# Altium schematic sheet Main.SchDoc
size A3; SheetNumber: 1; SheetTotal: 1
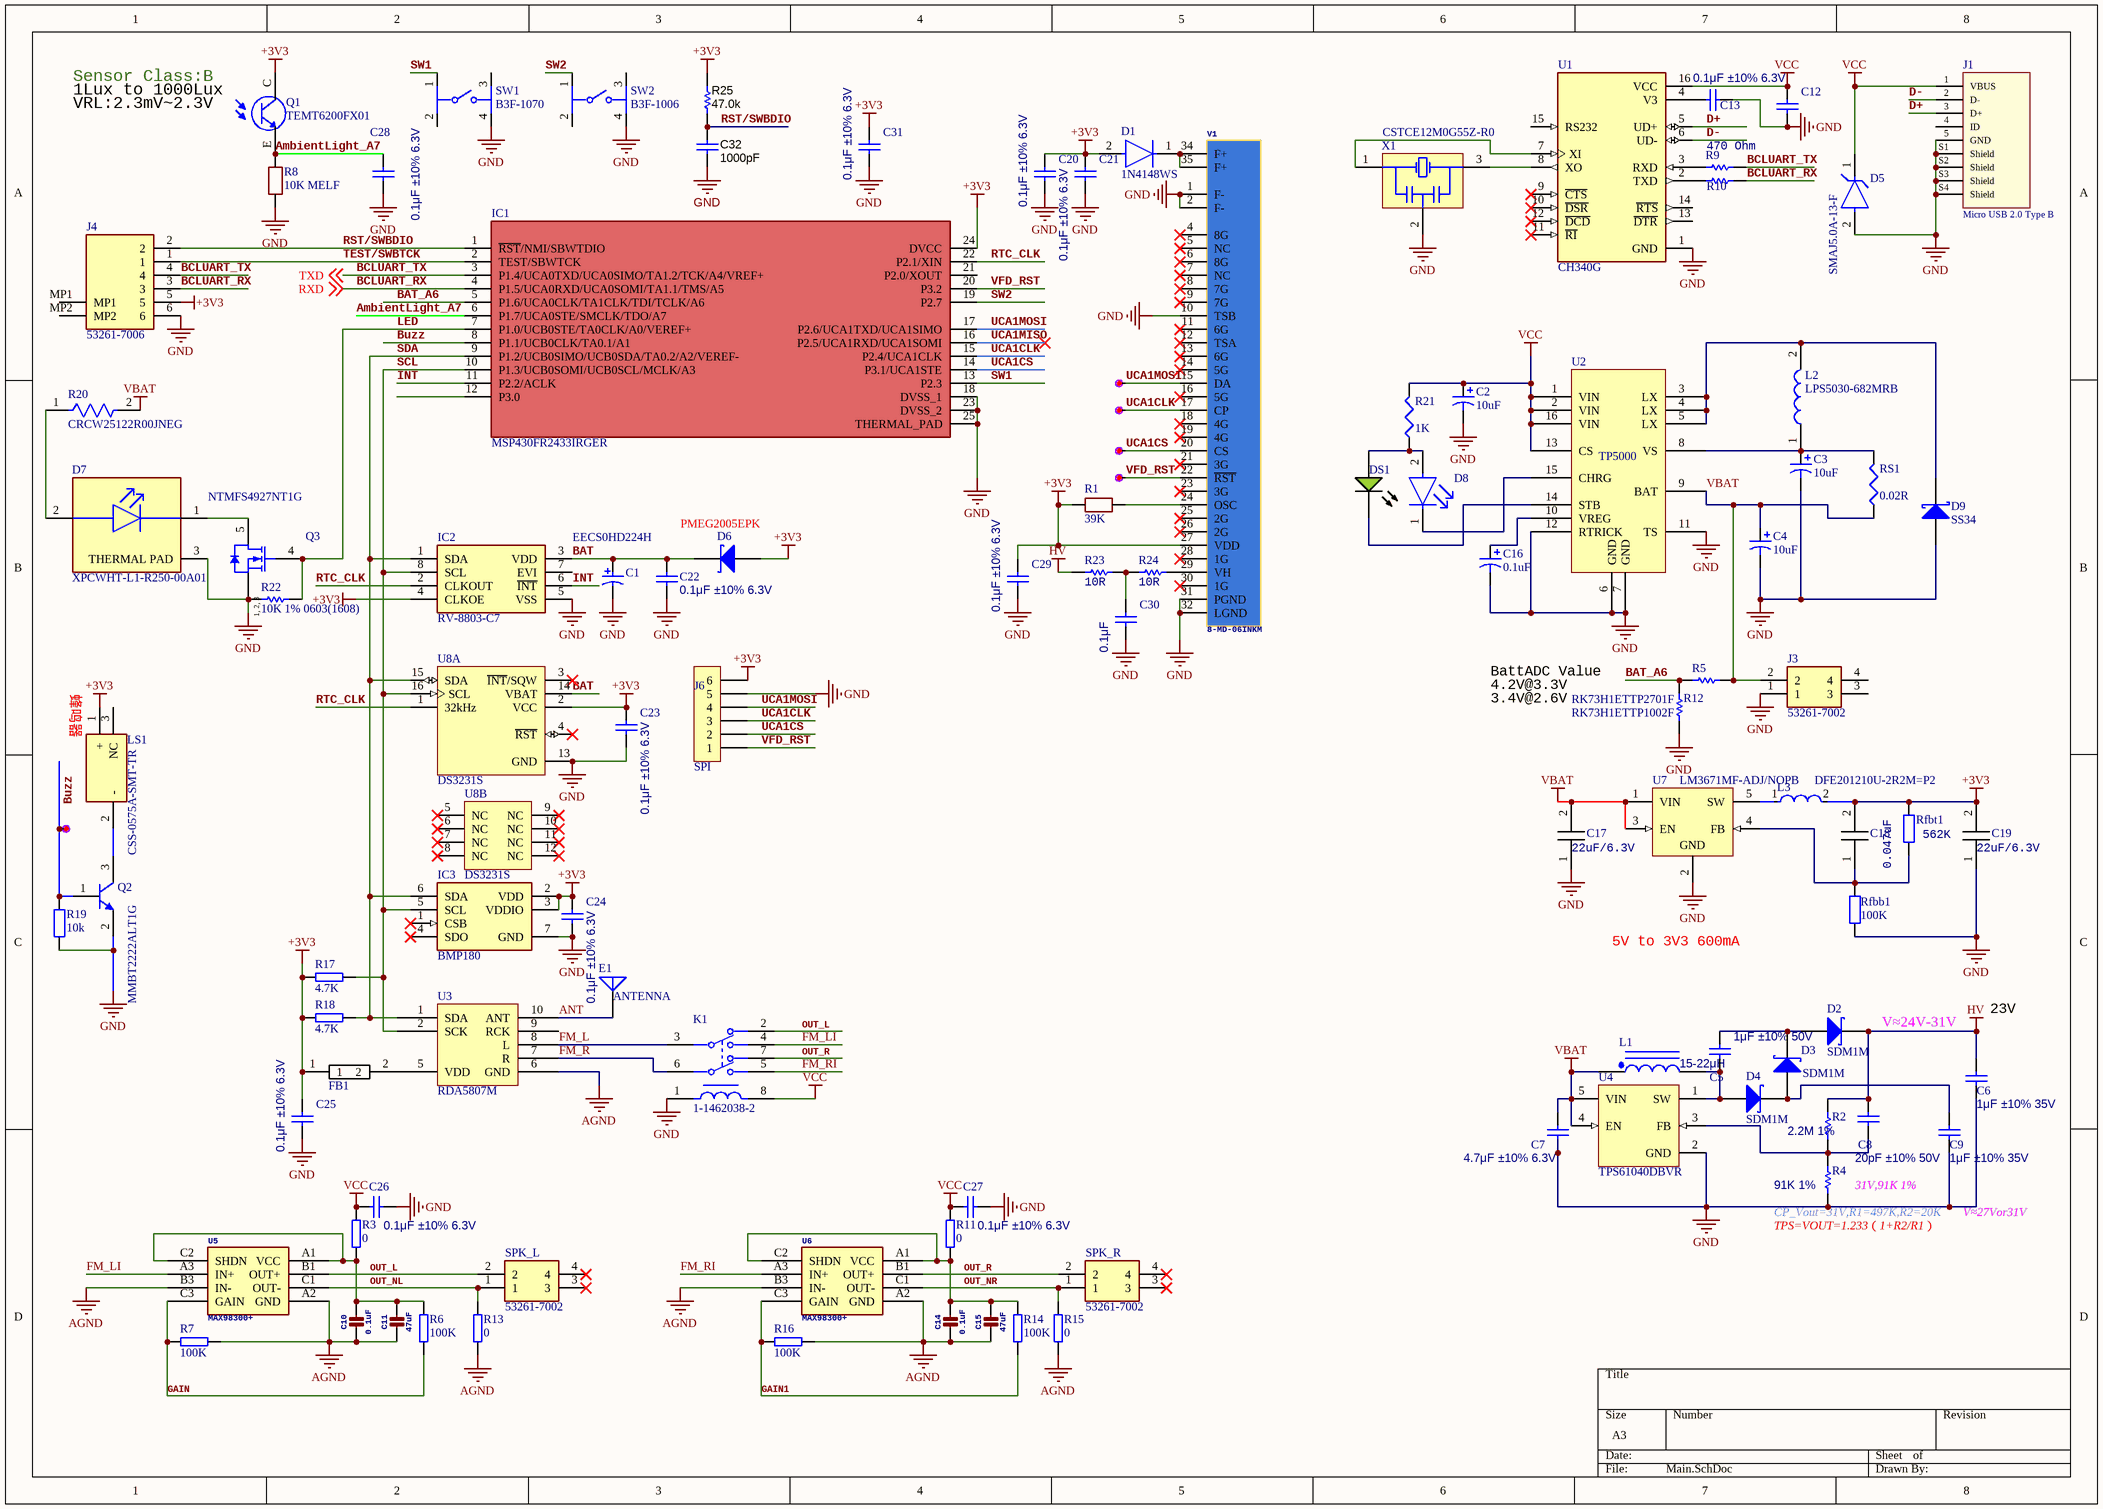
[diagram p0: Main.SchDoc]

## Parts
C1  EECS0HD224H  [PNSC-EECS0HD224H]
C2  value 10uF  [1210]  (hidden comment: Cap Pol3)
C3  value 10uF  [1206]  (hidden comment: Cap Pol3)
C4  value 10uF  [1206]  (hidden comment: Cap Pol3)
C5  1μF ±10% 50V  [0402 CAP - s]
C6  1μF ±10% 35V  [0603 cap - S]
C7  4.7μF ±10% 6.3V  [0402 Cap - S]
C8  20pF ±10% 50V  [0402 CAP - s]
C9  1μF ±10% 35V  [0402 Cap - S]
C10  0.1uF  [0201]
C11  47uF  [_0805MP]
C12  0.1μF ±10% 6.3V  [0603 cap - S]
C13  0.1μF ±10% 6.3V  [0603 cap - S]  (value not drawn)
C14  0.1uF  [0201]
C15  47uF  [_0805MP]
C16  value 0.1uF  [0603]  (hidden comment: Cap Pol3)
C17  value 22uF/6.3V  [0603-CAP]  (hidden comment: GRM188R60J226ME15D)
C18  value 0.047uF  [0201]  (hidden comment: GRM033C81A473KE05D)
C19  value 22uF/6.3V  [0603-CAP]  (hidden comment: GRM188R60J226ME15D)
C20  0.1μF ±10% 6.3V  [0603 cap - S]
C21  0.1μF ±10% 6.3V  [0603 cap - S]
C22  0.1μF ±10% 6.3V  [0603 cap - S]
C23  0.1μF ±10% 6.3V  [0603 cap - S]
C24  0.1μF ±10% 6.3V  [0603 cap - S]
C25  0.1μF ±10% 6.3V  [0603 cap - S]
C26  0.1μF ±10% 6.3V  [0603 cap - S]
C27  0.1μF ±10% 6.3V  [0603 cap - S]
C28  0.1μF ±10% 6.3V  [0603 cap - S]
C29  0.1μF ±10% 6.3V  [0603 cap - S]
C30  0.1μF  [0603 cap - S]
C31  0.1μF ±10% 6.3V  [0603 cap - S]
C32  ValueDisplayed: 1000pF  [0402]  (hidden comment: GRM155R71H102KA01D)
D1  1N4148WS  [FP-477AB-IPC_C]
D2  SDM1M  [DFN1608-2-UDFN1608]
D3  SDM1M  [DFN1608-2-UDFN1608]
D4  SDM1M  [DFN1608-2-UDFN1608]
D5  SMAJ5.0A-13-F  [FP-SMA-MFG]
D6  PMEG2005EPK  [DFN1608-2-UDFN1608]
D7  XPCWHT-L1-R250-00A01  [FP-XPCWHT-MFG]
D8  VLMW1300-GS08  [FP-6_541-5091_01-4-MFG]  (value not drawn)
D9  SS34  [SMB]
DS1  ASMT-RF45-AN002  [AVAG-ASMT-RF45_V]  (value not drawn)
E1  ANTENNA  [P125-B]
FB1  MPZ1608S260ATAH0  [BEADC1608X75N]  (value not drawn)
IC1  MSP430FR2433IRGER  [QFN50P400X400X100-25N-D]
IC2  RV-8803-C7  [RV8803C7]
IC3  BMP180  [BMP180]
J1  Micro USB 2.0 Type B  [629105136821]
J3  53261-7002  [532617002]
J4  53261-7006  [MX 1.25-WS-6P]
J6  SPI  [SIP6]
K1  1-1462038-2  [FP-1-1462038-2-MFG]
L1  value 15-22μH  [NRS4012]  (hidden comment: Inductor Iron Dot)
L2  LPS5030-682MRB  [LPS5030]
L3  DFE201210U-2R2M=P2  [FP-DFE201210U-MFG]
LS1  CSS-0575A-SMT-TR  [CSS0575ASMTTR]
Q1  TEMT6200FX01  [XDCR_TEMT6200FX01]
Q2  MMBT2222ALT1G  [ONSC-SOT-23-3-318-08_V]
Q3  NTMFS4927NT1G  [ONSC-DFN-5-488AA_V]
R1  39K  [MELF1]
R2  2.2M 1%  [0402 res - s]
R3  0  [0603]
R4  91K 1%  [0402 res - s]
R5  RK73H1ETTP2701F  [RESC1005X40X25LL10T10]
R6  100K  [0201]
R7  100K  [0201]
R8  10K MELF  [MELF-R3216-1206]
R9  Resistance: 470 Ohm  [RESC1608X55X25LL10T15]  (hidden comment: RC0603FR-07470RL)
R10  RC0603FR-07470RL  [RESC1608X55X25LL10T15]  (value not drawn)
R11  0  [0603]
R12  RK73H1ETTP1002F  [RESC1005X40X25NL10T10]
R13  0  [0201]
R14  100K  [0201]
R15  0  [0201]
R16  100K  [0201]
R17  4.7K  [0603]
R18  4.7K  [0603]
R19  10k  [0603 RES]
R20  CRCW25122R00JNEG  [FP-CRCW2512-e3-IPC_C]
R21  value 1K  [0603]
R22  10K 1% 0603(1608)  [RESC0603(1608)_N]
R23  Parameter 1: 10R  [RESC1609X55X30NL10T20]  (hidden comment: TNPW060310R0BEEA)
R24  Parameter 1: 10R  [RESC1609X55X30NL10T20]  (hidden comment: TNPW060310R0BEEA)
R25  ValueDisplayed: 47.0k  [0402]  (hidden comment: RC0402FR-0747KL)
Rfbb1  value 100K  [0201]  (hidden comment: RC0201JR-13100KL)
Rfbt1  Parameter 1: 562K  [0201]  (hidden comment: RC0201FR-07309KL)
RS1  value 0.02R  [1206]
SPK_L  53261-7002  [532617002]
SPK_R  53261-7002  [532617002]
SW1  B3F-1070  [FP-B3F-1070-MFG]
SW2  B3F-1006  [FP-B3F-1006-MFG]
TP1  Buzz  [TestPoint-SMT 0.8MM]  (value not drawn)
TP2  Buzz  [TestPoint-SMT 0.8MM]  (value not drawn)
TP3  Buzz  [TestPoint-SMT 0.8MM]  (value not drawn)
TP4  Buzz  [TestPoint-SMT 0.8MM]  (value not drawn)
TP5  Buzz  [TestPoint-SMT 0.8MM]  (value not drawn)
U1  CH340G  [SOIC127P600X180-16N]
U2  TP5000  [QFN-16]
U3  RDA5807M  [RDA5807M]
U4  TPS61040DBVR  [DBV0005A_N]
U5  MAX98300+  [WLP-9]
U6  MAX98300+  [WLP-9]
U7  LM3671MF-ADJ/NOPB  [DBV0005A_N]
U8  DS3231S  [W16-H2_L]  (parts A,B of 2)
V1  8-MD-06INKM  [Futaba 8-MD6INKM]
X1  CSTCE12M0G55Z-R0  [MURA-CSTCE_G_V]

## Nets
+3V3: C18.2 C19.2 C20.2 C21.2 C23.2 C24.2 C25.2 C29.2 C31.2 D1.2(A) D6.A FB1.1 IC1.24(DVCC) IC2.4(CLKOE) IC3.2(VDD) IC3.3(VDDIO) J4.5 J6.6 L3.2 LS1.1(+) Q1.C R1.2 R17.2 R18.2 R25.2 Rfbt1.1 U8.2(VCC) V1.27(VDD)
AGND: C10.2 C11.2 C14.2 C15.2 R7.2 R13.2 R15.2 R16.2 U3.6(GND) U5.A2(GND) U5.B3(IN-) U6.A2(GND) U6.B3(IN-)
GND: C1.2 C2.2 C3.2 C4.2 C6.1 C7.1 C9.1 C12.1 C13.1 C16.2 C17.1 C19.1 C20.1 C21.1 C22.1 C23.1 C24.1 C25.1 C26.1 C27.1 C28.1 C29.1 C30.1 C31.1 C32.2 D5.2(A) D7.3(THERMAL_PAD) D9.1(A) IC1.18(DVSS_1) IC1.23(DVSS_2) IC1.25(THERMAL_PAD) IC2.5(VSS) IC3.7(GND) J1.5(GND) J1.S1(Shield) J1.S2(Shield) J1.S3(Shield) J1.S4(Shield) J3.1 J4.6 J6.5 K1.1 Q2.2(E) Q3.1(S) Q3.2(S) Q3.3(S) R4.2 R8.1 R12.1 R19.2 R22.1 Rfbb1.2 SW1.4 SW2.4 U1.1(GND) U2.6(GND) U2.7(GND) U2.11(TS) U2.12(RTRICK) U4.2(GND) U7.2(GND) U8.13(GND) V1.1(F-) V1.2(F-) V1.10(TSB) V1.31(PGND) V1.32(LGND) X1.2(GND)
HV: C6.2 C8.2 D2.K R2.1 R23.1
VBAT: C4.1 C7.2 C17.2 J3.2 L1.1 R5.2 R20.2 RS1.1 U2.9(BAT) U4.4(EN) U4.5(VIN) U7.1(VIN) U7.3(EN)
VCC: C2.1 C12.2 C26.2 C27.2 D5.1(C) J1.1(VBUS) K1.8 R3.2 R11.2 R21.2 U1.16(VCC) U2.1(VIN) U2.2(VIN) U2.13(CS) U2.16(VIN)
AmbientLight_A7: C28.2 IC1.6(P1.7/UCA0STE/SMCLK/TDO/A7) Q1.E R8.2
ANT: E1.1(A) U3.10(ANT)
BAT: C1.1 C22.2 D6.K IC2.3(VDD) U8.14(VBAT)
BAT_A6: IC1.5(P1.6/UCA0CLK/TA1CLK/TDI/TCLK/A6) R5.1 R12.2
BCLUART_RX: IC1.4(P1.5/UCA0RXD/UCA0SOMI/TA1.1/TMS/A5) J4.3 R10.2 ; off-sheet RXD  [also labelled RXD]
BCLUART_TX: IC1.3(P1.4/UCA0TXD/UCA0SIMO/TA1.2/TCK/A4/VREF+) J4.4 R9.2 ; off-sheet TXD  [also labelled TXD]
Buzz: IC1.8(P1.1/UCB0CLK/TA0.1/A1) Q2.1(B) R19.1 TP1.1
D+: J1.3(D+) U1.5(UD+)
D-: J1.2(D-) U1.6(UD-)
FM_L: K1.3 U3.8(L)
FM_LI: K1.4 U5.A3(IN+)
FM_R: K1.6 U3.7(R)
FM_RI: K1.5 U6.A3(IN+)
GAIN: R6.2 R7.1 U5.C3(GAIN)
GAIN1: R14.2 R16.1 U6.C3(GAIN)
INT: IC1.11(P2.2/ACLK) IC2.6(~{INT})
LED: IC1.7(P1.0/UCB0STE/TA0CLK/A0/VEREF+) Q3.4(G) R22.2
OUT_L: K1.2 SPK_L.2 U5.B1(OUT+)
OUT_NL: R13.1 SPK_L.1 U5.C1(OUT-)
OUT_NR: R15.1 SPK_R.1 U6.C1(OUT-)
OUT_R: K1.7 SPK_R.2 U6.B1(OUT+)
RST/SWBDIO: C32.1 IC1.1(~{RST}/NMI/SBWTDIO) J4.2 R25.1
RTC_CLK: IC1.22(P2.1/XIN) IC2.2(CLKOUT) U8.1(32kHz)
SCL: IC1.10(P1.3/UCB0SOMI/UCB0SCL/MCLK/A3) IC2.8(SCL) IC3.5(SCL) R17.1 U3.2(SCK) U8.16(SCL)
SDA: IC1.9(P1.2/UCB0SIMO/UCB0SDA/TA0.2/A2/VEREF-) IC2.1(SDA) IC3.6(SDA) R18.1 U3.1(SDA) U8.15(SDA)
SW1: IC1.13(P2.3) SW1.1
SW2: IC1.19(P2.7) SW2.1
TEST/SWBTCK: IC1.2(TEST/SBWTCK) J4.1
UCA1CLK: IC1.15(P2.4/UCA1CLK) J6.3 TP3.1 V1.17(CP)
UCA1CS: IC1.14(P3.1/UCA1STE) J6.2 TP4.1 V1.20(CS)
UCA1MISO: IC1.16(P2.5/UCA1RXD/UCA1SOMI)
UCA1MOSI: IC1.17(P2.6/UCA1TXD/UCA1SIMO) J6.4 TP2.1 V1.15(DA)
VFD_RST: IC1.20(P3.2) J6.1 TP5.1 V1.22(~{RST})
NetC3_1: C3.1 L2.1 RS1.2 U2.8(VS)
NetC5_1: C5.1 D4.A L1.2 U4.1(SW)
NetC5_2: C5.2 D2.A D3.K
NetC8_1: C8.1 R2.2 R4.1 U4.3(FB)
NetC9_2: C9.2 D3.A D4.K
NetC10_1: C10.1 C11.1 R3.1 R6.1 U5.A1(VCC) U5.C2(SHDN)
NetC13_2: C13.2 U1.4(V3)
NetC14_1: C14.1 C15.1 R11.1 R14.1 U6.A1(VCC) U6.C2(SHDN)
NetC16_1: C16.1 U2.10(VREG)
NetC18_1: C18.1 Rfbb1.1 Rfbt1.2 U7.4(FB)
NetC30_2: C30.2 R23.2 R24.1
NetD1_1: D1.1(C) V1.34(F+) V1.35(F+)
NetD7_1: D7.1(C) Q3.5(D)
NetD7_2: D7.2(A) R20.1
NetD8_1: D8.1(C) U2.15(CHRG)
NetD8_2: D8.2(A) DS1.1(A) R21.1
NetD9_2: D9.2(K) L2.2 U2.3(LX) U2.4(LX) U2.5(LX)
NetDS1_2: DS1.2(K) U2.14(STB)
NetFB1_2: FB1.2 U3.5(VDD)
NetL3_1: L3.1 U7.5(SW)
NetLS1_2: LS1.2(-) Q2.3(C)
NetR1_1: R1.1 V1.24(OSC)
NetR9_1: R9.1 U1.3(RXD)
NetR10_1: R10.1 U1.2(TXD)
NetR24_2: R24.2 V1.29(VH)
NetU1_7: U1.7(XI) X1.1(X1)
NetU1_8: U1.8(XO) X1.3(X2)

Not connected (* = marked no-connect by the designer): IC1 12(P3.0) 21(P2.0/XOUT); IC2 7(EVI); IC3 1(CSB)* 4(SDO)*; J1 4(ID); J3 3 4; J4 MP1 MP2; LS1 3(NC); SPK_L 3* 4*; SPK_R 3* 4*; SW1 2 3; SW2 2 3; U1 9(~{CTS})* 10(~{DSR})* 11(~{RI})* 12(~{DCD})* 13(~{DTR}) 14(~{RTS}) 15(RS232); U3 9(RCK); U8 3(~{INT}/SQW)* 4(~{RST})* 5(NC)* 6(NC)* 7(NC)* 8(NC)* 9(NC)* 10(NC)* 11(NC)* 12(NC)*; V1 4(8G)* 5(NC)* 6(8G)* 7(NC)* 8(7G)* 9(7G)* 11(6G)* 12(TSA)* 13(6G)* 14(5G)* 16(5G)* 18(4G)* 19(4G)* 21(3G)* 23(3G)* 25(2G)* 26(2G)* 28(1G)* 30(1G)*

## Notes on the sheet
- 1Lux to 1000Lux
- VRL:2.3mV~2.3V
- Sensor Class:B
- (near LS1) 蜂鸣器
- 4.2V@3.3V
- 3.4V@2.6V
- BattADC Value
- 5V to 3V3 600mA
- V≈24V-31V
- 23V
- (near R4) 31V,91K 1%
- (near R4) TPS=VOUT=1.233（1+R2/R1）
- (near R4) CP_Vout=31V,R1=497K,R2=20K
- V≈27Vor31V
- (in symbol CMP-1058-00189-1) 1, 2, 3

## Library data of the parts
C1 = CMP-2000-06198-1: Stacked Coin Type Capacitor, 0.22 F, +/- 80%, 5.5 VDC, -25 to 70 degC, 2-Pin THD, RoHS, Bulk; Manufacturer: Panasonic; ESR (Equivalent Series Resistance): 75Ohm@1kHz; Online Catalog: SDSeries; Other Names: EECS0HD224H / P10788; Catalog Drawings: SDSeriesHorizontalSide1 / SDSeriesHorizontalTop / SDSeriesHorizontalSide2; Voltage - Rated: 5.5V; Lifetime @ Temp.: 1000Hrs@70°C; Tolerance: -20%,+80%; Capacitance: 220mF; Lead Spacing: 0.394"(10.00mm); Series: SD; Termination: ThroughHole; Package Reference: EECS0HD224H; Standard Package: 200; Packaging: Bulk; Mounting Technology: ThroughHole; Manufacturer URL: http://www.panasonic.com/; Height - Seated (Max): 0.236"(6.00mm); Size / Dimension: 0.413"Dia(10.50mm); Operating Temperature: -25°C~70°C; Package Description: 2-Pin Through Hole Device, Dia 10.5 mm (Max), Height 6 mm, Lead Spacing 10 mm; Package / Case: Axial,Can-Horizontal; Category: Capacitors; Mounting Type: ThroughHole; Datasheet Version: 08/2016; Datasheet URL: https://industrial.panasonic.com/cdbs/www-data/pdf/RDG0000/ABC0000C84.pdf; Family: ElectricDoubleLayerCapacitors,Supercaps
C2-C4 C16 = Cap Pol3: Polarized Capacitor (Surface Mount); Published: 8-Jun-2000; LatestRevisionDate: 29-May-2009; LatestRevisionNote: IPC-7351 Footprint Added.; PackageReference: C0805; Publisher: Altium Limited; PackageDescription: Chip Capacitor
C5 C8 = Cap SMD: Cap0402,CL05A105KQ5NNNC C52923; RealPack: CAP 0402
C6 C7 C9 C12 C13 C20-C31 = Cap SMD: Cap 0603
C10 C11 C14 C15 = CAP_CERAMIC_0805MP: Ceramic CapacitorsFor new designs, use the packages preceded by an '_' character since they are more reliable:The following footprints should be used on most boards:For extremely tight-pitch boards where space is at a premium, the following 'micro-pitch' footprints can be used (smaller pads, no silkscreen outline, etc.):; GateName_1: G$1; SymbolName_1: CAPACITOR; DeviceName: _0805MP; LibraryName: microbuilder; DeviceSetName: CAP_CERAMIC
C17 C19 = ZRB18AR61A226ME01L: 22uF/6.3V; Manufacturer_Name: Murata Electronics; Height: 1.2mm; Manufacturer_Part_Number: ZRB18AR61A226ME01L
C18 = GRM155R71E473KA88D: CAP, CERM, 0.047uF, 10V, ±10%, X7R, 0201; Manufacturer_Name: Murata Electronics; Datasheet Link: http://www.murata.com/~/media/webrenewal/support/library/catalog/products/capacitor/mlcc/c02e.pdf; Height: 0.55mm; Manufacturer_Part_Number: GRM155R71E473KA88D; Mouser Part Number: 81-GRM155R71E473KA88; Mouser Price/Stock: https://www.mouser.com/Search/Refine.aspx?Keyword=81-GRM155R71E473KA88; RS Part Number: 7235256P; RS Price/Stock: http://uk.rs-online.com/web/p/products/7235256P
C32 = GRM155R71H102KA01D: CAP, CERM, 1000 pF, 50 V, +/- 10%, X7R, 0402; Manufacturer: MuRata; Polarized: N; CompType: Capacitor; Value: 1000pF; U/M: EA; Cap_F: 0.000000001; Tolerance_%: 10; Value1: Unknown; VDC_V: 50; Value2: 50V; TaMin_C: -55; TaMax_C: 125; SizeArea_mm2: 0.5; SizeAreaWB_mm2: 3; SizeX_mm: 1; SizeZ_mm: 0.6; AEC Category: Q200; SymbolVersion: 2008-07-09; PartNumber: GRM155R71H102KA01D; PackageReference: 0402; RoHS: Y; MountType: SMT; Technology: Ceramic; TempCo: X7R; Cap_Case: 0402; SizeY_mm: 0.5; Published: 2008-06-19; Publisher: Texas Instruments; LatestRevisionDate: 2017-01-30; ComponentLink1Description: Datasheet link; ComponentLink1URL: http://search.murata.co.jp/Ceramy/PnsearchViewAction.do?HnOFG=ON&HnNFG=ON&SEL_CNT=50&sLang=en&sKey=GRM155R71H102KA01D&x=9&y=9&search=startwith; Supplier 1: Digi-Key; Supplier Part Number 1: 490-1303-1-ND; Supplier 2: Mouser; Supplier Part Number 2: 81-GRM36X102K50; Supplier 3: Farnell; Supplier Part Number 3: 1828882; AEC Qualified: ?
D1 = CMP-07163-000040-1: DIODE GEN PURP 75V 150MA SOD323F; Recovery Time: 4ns; Peak Reverse Current: 5uA; Forward Voltage: 1V; Power Dissipation: 200mW; Element Configuration: Single; Max Forward Surge Current (Ifsm): 2A; Width: 1.35mm; Average Rectified Current: 150mA; Length: 1.8mm; Forward Current: 150mA; Max Operating Temperature: 150°C; Reverse Voltage: 75V; REACH SVHC: No SVHC; Weight: 0.0276g; Reverse Recovery Time: 4ns; Min Operating Temperature: -55°C; Package Quantity: 1; Mount: Surface Mount; Lead Free: Lead Free; Contact Plating: Tin; Radiation Hardening: No; Max Repetitive Reverse Voltage (Vrrm): 75V; Number of Pins: 2; Max Reverse Voltage (DC): 75V; Packaging: Tape and Reel; Height: 1mm
D2-D4 D6 = Diode_Schotty: Schotty Diodes
D5 = CMP-12828-000007-1: TVS DIODE 5V 9.2V SMA; Manufacturer: Diodes Inc.; Peak Pulse Power: 400W; Number Of Channels: 1; Max Junction Temp: +150°C; Peak Pulse Current: 43.5A; Breakdown Voltage: 6.4V; Direction: Unidirectional; Standoff Height: 0.05mm; Device Class L3: unset; Mouser Description: TVS DIODE 5V 9.2V SMA; Device Class L1: Circuit Protection; Temperature Range High: +150°C; Category: Diode; ComponentLink2Description: Datasheet; Temperature Range Low: -55°C; Manufacturer Part Number: SMAJ5.0A-13-F; Device Class L2: TVS Diodes; RoHS: TRUE; Automotive: No; Footprint Url: https://www.diodes.com/assets/Package-Files/SMA.pdf; Reverse Standoff Voltage: 5V; Clamping Voltage: 9.2V; Temperature: -55°C to +150°C; Height: 2.4mm; Octopart: https://octopart.com/smaj5.0a-13-f-diodes+inc.-350158; Lead Free: Yes; Digikey Description: TVS DIODE 5V 9.2V SMA; Package: SMA; ComponentLink2URL: https://www.diodes.com/assets/Datasheets/ds19005.pdf
D7 = CMP-13977-000007-1: LED XLAMP COOL WHITE 70CRI 2SMD; Manufacturer: Cree Inc.; Luminous Flux: 87.4lm; Max Junction Temp: +150°C; Forward Voltage: 3.2V; Forward Current: 350mA; Led Orientation: Top View; Viewing Angle: 115°; Reverse Voltage: 5V; ComponentLink2URL: https://www.cree.com/led-components/media/documents/XLampXPC.pdf; Mouser Description: High Brightness LED, XLamp XP-C Series, Cool White, 10000 K, 87.4 lm, 350 mA, 500 mA; Lead Free: Yes; Package: XPCWHT; Device Class L1: Optoelectronics; Temperature Range High: +150°C; RoHS: TRUE; Category: Diode; Device Class L2: LEDs; Octopart: https://octopart.com/xpcwht-l1-r250-00a01-cree-9519579; ComponentLink2Description: Datasheet; Temperature: to +150°C; Automotive: No; Digikey Description: LED XLAMP COOL WHITE 70CRI 2SMD; Colour: White; Device Class L3: unset; Manufacturer Part Number: XPCWHT-L1-R250-00A01; Height: 2.13mm
D8 = CMP-02520-000007-1: LED COOL WHITE 0603 SMD; Manufacturer: Vishay; Viewing Angle: 130°; Forward Voltage: 3.15V; Luminous Intensity: 180mcd; Forward Current: 5mA; Led Orientation: Top View; Power Dissipation: 70mW; Category: Diode; Manufacturer Part Number: VLMW1300-GS08; Device Class L2: LEDs; Device Class L1: Optoelectronics; ComponentLink2URL: http://www.vishay.com/docs/82435/vlmw1300.pdf; Octopart: https://octopart.com/vlmw1300-gs08-vishay-21709203; Mouser Description: LED; SMD; 0603; white cold; 45-180mcd; 7000(typ)K; 130°; 5mA; Automotive: No; Ambient Temperature Range High: +80°C; Colour: White; Device Class L3: unset; Temperature Range High: +80°C; Height: 0.75mm; Package: 6.541-5091.01-4; RoHS: TRUE; Digikey Description: LED COOL WHITE 0603 SMD; Lead Free: Yes; Ambient Temperature Range Low: -20°C; ComponentLink2Description: Datasheet; Temperature Range Low: -20°C; Temperature: -20°C to +80°C
D9 = D Schottky: Schottky Diode; Published: 8-Jun-2000; LatestRevisionDate: 17-Jul-2002; LatestRevisionNote: Re-released for DXP Platform.; PackageReference: SMB; Publisher: Altium Limited; PackageDescription: DO-214-AA/SMB; 2 C-Bend Leads; Body 5.3 x 3.6 mm, inc. leads (LxW); Code_JEDEC: DO-214-AA
DS1 = CMP-2000-05796-1: LED Yellow - Green, 48 mW, 20 mA, -40 to 100 degC, 2-Pin SMD, RoHS, Tape and Reel; Manufacturer: Avago; Luminous Intensity: 60mcd; Type: Uni-Color; Viewing Angle: 145deg; Product Height (mm): 0.45mm; Emitting Color: YellowGreen; Test Current (It): 20mA; Dominant Wave Length: 573nm; Power Dissipation: 48W; Shape Type: Rectangular; Rad Hardened: No; High Brightness: Yes; Lens Type: ColorlessDiffused; Peak Wavelength: 574nm; Product Length (mm): 1.6mm; DELETED: Compliant; Reverse Voltage: 5V; Number of  Elements: 1; Product Depth (mm): 0.8mm; Main Category: ChipLED; Chip Material: AlGaInP; Forward Voltage: 2.4V; Operating Temp Range: -40Cto100C; Packaging: TapeandReel; Package Reference: ASMT-RF45; Operating Temperature Classification: Industrial; Manufacturer URL: http://www.avagotech.com/; Forward Current: 20mA; Pin Count: 2; Package Description: 2-Pin Surface Mount Device, Body 1.6 x 0.8 mm; Datasheet Version: 11/2007; Mounting Technology: SurfaceMount; Mounting: SurfaceMount; Package Type: ChipLed; Datasheet URL: https://datasheet.ciiva.com/1244/80864-1244128.pdf
E1 = ANTENNA: Generic Antenna
FB1 = MPZ1608S260ATAH0: Ferrite Bead; Manufacturer_Name: TDK; Datasheet Link: https://product.tdk.com/info/en/catalog/datasheets/beads_commercial_power_mpz1608_en.pdf; Height: 0.75mm; Manufacturer_Part_Number: MPZ1608S260ATAH0; Mouser Part Number: 810-MPZ1608S260ATAH0; Mouser Price/Stock: https://www.mouser.com/Search/Refine.aspx?Keyword=810-MPZ1608S260ATAH0
IC1 = MSP430FR2433IRGER: Integrated Circuit; Manufacturer_Name: Texas Instruments; Datasheet Link: http://www.ti.com/lit/ds/symlink/msp430fr2433.pdf; Height: 1mm; Manufacturer_Part_Number: MSP430FR2433IRGER; Mouser Part Number: 595-SP430FR2433IRGER; Mouser Price/Stock: https://www.mouser.co.uk/ProductDetail/Texas-Instruments/MSP430FR2433IRGER?qs=bY1dm4K8r4V%252BMVYjdzQOVg%3D%3D; Arrow Part Number: MSP430FR2433IRGER; Arrow Price/Stock: https://www.arrow.com/en/products/msp430fr2433irger/texas-instruments?region=nac
IC2 = RV-8803-C7: Integrated Circuit; Manufacturer_Name: Micro Crystal AG; Datasheet Link: https://www.microcrystal.com/fileadmin/Media/Products/RTC/Datasheet/RV-8803-C7.pdf; Height: 0.8mm; Manufacturer_Part_Number: RV-8803-C7
IC3 = BMP180: Integrated Circuit; Manufacturer_Name: Bosch Sensortec; Datasheet Link: https://datasheet.datasheetarchive.com/originals/distributors/Datasheets-DGA1/140503.pdf; Manufacturer_Part_Number: BMP180; Mouser Part Number: 262-BMP180; Mouser Price/Stock: https://www.mouser.co.uk/ProductDetail/Bosch-Sensortec/BMP180?qs=d72FGnIDsgTlLIC5YM2WKA%3D%3D
J1 = 629105136821: Micro USB 2.0 Type B Horizontal SMT 5 Contacts WR-COM; Rated Current: 1 A; Gender: Female; ComponentLink1Description: Manufacturer; ComponentLink1URL: http://www.we-online.de; ComponentLink2Description: Datasheet; ComponentLink2URL: http://katalog.we-online.de/em/datasheet/629105136821.pdf; Part Number: 629105136821; Published Date: May 2018; Publisher: Wurth Elektronik; Orientation: Horizontal; Interface Type: Micro USB 2.0 Type B; Operating Temperature: -40 to 85 degC; Mounting Technology: SMT; Packaging: Tape and Reel
J3 SPK_L SPK_R = 53261-7002: Connector; Manufacturer_Name: Molex; Datasheet Link: https://www.molex.com/pdm_docs/sd/532617002_sd.pdf; Height: 3.4mm; Manufacturer_Part_Number: 53261-7002; Mouser Part Number: 538-53261-7002; Mouser Price/Stock: https://www.mouser.co.uk/ProductDetail/Molex/53261-7002?qs=0lSvoLzn4L%2F9TYfu1Dmicg%3D%3D
J4 = 53261-7006: Connector; Manufacturer_Name: Molex; Datasheet Link: https://componentsearchengine.com/Datasheets/1/53261-7006.pdf; Height: 3.6mm; Manufacturer_Part_Number: 53261-7006; Mouser Part Number: 538-53261-7006; Mouser Price/Stock: https://www.mouser.co.uk/ProductDetail/Molex/53261-7006?qs=0lSvoLzn4L%2FSBef0BTU2GA%3D%3D
J6 = CON6: Connector
K1 = CMP-03396-000036-1: RELAY TELECOM DPDT 2A 4.5V; Manufacturer: TE Connectivity; Coil Resistance: 145Ω; Number Of Contacts: 2; Switching Power: 60W; Coil Type: Non-Latching; Coil Power: 140mW; Standoff Height: 0.25mm; Ambient Temperature Range Low: -40°C; ComponentLink2Description: Datasheet; Device Class L2: Relays; Octopart: https://octopart.com/1-1462038-2-te+connectivity-40642255; Package: 1-1462038-2; ComponentLink2URL: https://www.te.com/commerce/DocumentDelivery/DDEController?Action=showdoc&DocId=Specification+Or+Standard%7F108-98001%7FW5%7Fpdf%7FEnglish%7FENG_SS_108-98001_W5.pdf%7F1-1462038-2; Switching Current: 2A; Device Class L3: Signal Relays; Height: 5.88mm; Manufacturer Part Number: 1-1462038-2; Device Class L1: Electromechanical; Ambient Temperature Range High: +85°C; Throw Configuration: DPDT; Current Rating: 2A; Lead Free: Yes; Temperature Range High: +85°C; Temperature Range Low: -40°C; Coil Voltage: 4.5V; Digikey Description: RELAY TELECOM DPDT 2A 4.5V; Temperature: -40°C to +85°C; Category: Relay; Automotive: No; RoHS: TRUE
L1 = Inductor Iron Dot: Magnetic-Core Inductor with Winding Polarity Marking; Published: 24-Mar-1999; LatestRevisionDate: 17-Jul-2002; LatestRevisionNote: Re-released for DXP Platform.; PackageReference: DIODE_SMC; Publisher: Altium Limited; PackageDescription: Diode; 2 Leads
L2 = LPS5030-562MRB: Inductor; Manufacturer_Name: COILCRAFT; Datasheet Link: https://componentsearchengine.com/Datasheets/1/LPS5030-562MRB.pdf; Manufacturer_Part_Number: LPS5030-562MRB; Mouser Part Number: 994-LPS5030-562MRB; Mouser Price/Stock: https://www.mouser.co.uk/ProductDetail/Coilcraft/LPS5030-562MRB?qs=QQJxVsr8EGZ8w6ebF9W%2FsQ%3D%3D
L3 = CMP-06042-016271-1: FIXED IND 2.2UH 1.2A 228 MOHM; RoHS Compliant: Yes
LS1 = CSS-0575A-SMT-TR: Loudspeaker or Buzzer; Manufacturer_Name: CUI Inc.; Datasheet Link: http://www.cui.com/product/resource/css-0575a-smt.pdf; Height: 2mm; Manufacturer_Part_Number: CSS-0575A-SMT-TR; Mouser Part Number: 490-CSS-0575A-SMT-TR; Mouser Price/Stock: https://www.mouser.co.uk/ProductDetail/CUI-Devices/CSS-0575A-SMT-TR?qs=WyjlAZoYn52WhHVOl0obVQ%3D%3D; Arrow Part Number: CSS-0575A-SMT-TR; Arrow Price/Stock: https://www.arrow.com/en/products/css-0575a-smt-tr/cui-devices
Q1 = TEMT6200FX01: Phototransistors 550nm Top View 0805 (2012 Metric); MF: {'manufacturer': u'Vishay Semiconductor Opto Division'}; Package: None; MP: TEMT6200FX01; Value: *; Availability: Unavailable; Price: None
Q2 = CMP-1048-00538-1: General Purpose Transistor, NPN Silicon, 3-Pin SOT-23, Pb-Free, Tape and Reel; Manufacturer: On Semiconductor; fT Min (MHz): 300; IC Continuous (A): 0.6; ComponentLink3URL: http://www.onsemi.cn/pub_link/Collateral/318-08.PDF; PartNumber: MMBT2222ALT1G; RoHS: TRUE; ComponentLink1URL: http://www.onsemi.com/; ComponentLink3Description: Package Specification; ComponentLink2Description: Datasheet; Mounting Technology: Surface Mount; Packing: Tape and Reel; PackageDescription: 3-Pin Small Outline Transistor, Body 2.92 x 1.3 mm, Pitch 0.95 mm; DatasheetVersion: Rev. 10; PackageReference: SOT-23-3-318-08; ComponentLink2URL: http://www.onsemi.cn/pub_link/Collateral/MMBT2222LT1-D.PDF; Polarity: NPN; PackageVersion: Rev. AP, 11/2009; ComponentLink1Description: Manufacturer URL
Q3 = CMP-1058-00189-1: Power MOSFET, 30 V, 38 A, Single N-Channel, 5-Pin DFN, Pb-Free, Tape and Reel; Manufacturer: On Semiconductor; VGS(th) Max (V): 2.2; Ciss Typ (pF): 913; VGS Max (V): 20; Coss Typ (pF): 366; Channel Polarity: N Channel; Qrr Typ (nC): 8.4; Crss Typ (pF): 108; ID Max (A): 38; V(BR)DSS Min (V): 30; Configuration: Single; ComponentLink2URL: http://www.onsemi.com/pub_link/Collateral/NTMFS4927N-D.PDF; ComponentLink2Description: Datasheet; ComponentLink3URL: http://www.onsemi.com/pub_link/Collateral/488AA.PDF; ComponentLink3Description: Package Specification; ComponentLink1Description: Manufacturer URL; PartNumber: NTMFS4927NT1G; Packing: Tape and Reel; Mounting Technology: Surface Mount; DatasheetVersion: Rev. 8; Package Type: SO-8FL / DFN-5; PackageVersion: Rev. H, 03/2013; Code_JEDEC: MO-240A; PackageReference: DFN-5-488AA; RoHS: Pb-Free; PackageDescription: 5-Pin Small Outline No-Lead, Body 4.9 x 5.9 mm, Pitch 1.27 mm; ComponentLink1URL: http://www.onsemi.com/
R1 R3 R6-R8 R11 R13-R18 = RES2: Resistor
R2 R4 = Res1: Resistor C11702; Published: 8-Jun-2000; LatestRevisionDate: 17-Jul-2002; LatestRevisionNote: Re-released for DXP Platform.; PackageReference: AXIAL-0.3; Publisher: Altium Limited; PackageDescription: Axial Device, Thru-Hole; 2 Leads; 0.3 in Pin Spacing; RealPack: RES 0402
R5 = CMP-2002-03828-1: Manufacturer: KOA Speer; Part Number: RK73H1ETTP2701F
R9 = CMP-1659-00035-1: General Purpose Chip Resistor, 470 Ohm, +/- 1%, -55 to 155 degC, 0603 (1608 Metric), RoHS, Tape and Reel; Impedance: 50 Ohm; Fastening Type: Snap; Min Operating Temperature: -40 degC; Length: 3 mm; PackageReference: 0603; Contact Material: Brass; Max Operating Temperature: 90 degC; ComponentLink2URL: https://datasheet.ciiva.com/11808/0900766b80f96399-11808177.pdf; Packaging: Tape and Reel; DatasheetVersion: Rev. 4, 04/2009; Contact Plating: Gold; Radiation Hardening: No; Height: 1.25 mm; RoHSCompliant: true; ComponentLink2Description: Datasheet; Package Quantity: 2500; ComponentLink1URL: http://www.yageo.com/; Width: 3.1 mm; Mount: Surface Mount; PackageDescription: 2-Pin Surface Mount Device, Body 1.6 x 0.8 mm; ComponentLink1Description: Manufacturer URL
R10 = CMP-1659-00035-1: General Purpose Chip Resistor, 470 Ohm, +/- 1%, -55 to 155 degC, 0603 (1608 Metric), RoHS, Tape and Reel; Impedance: 50 Ohm; Resistance: 470 Ohm; Fastening Type: Snap; Min Operating Temperature: -40 degC; Length: 3 mm; PackageReference: 0603; Contact Material: Brass; Max Operating Temperature: 90 degC; ComponentLink2URL: https://datasheet.ciiva.com/11808/0900766b80f96399-11808177.pdf; Packaging: Tape and Reel; DatasheetVersion: Rev. 4, 04/2009; Contact Plating: Gold; Radiation Hardening: No; Height: 1.25 mm; RoHSCompliant: true; ComponentLink2Description: Datasheet; Package Quantity: 2500; ComponentLink1URL: http://www.yageo.com/; Width: 3.1 mm; Mount: Surface Mount; PackageDescription: 2-Pin Surface Mount Device, Body 1.6 x 0.8 mm; ComponentLink1Description: Manufacturer URL
R12 = CMP-2002-03809-1: Manufacturer: KOA Speer; Part Number: RK73H1ETTP1002F
R19 = R: 贴片电阻; 版权归属: 源创客; BOM名称: 贴片电阻; 学习资源: www.ooocke.com
R20 = CMP-02407-006382-1: RES Thick Film, 2Ω, 5%, 1W, 200ppm/°C, 2512; Voltage Rating (DC): 500V; Resistance: 2R; Power Rating: 1W; Min Operating Temperature: -55°C; Temperature Coefficient: 200ppm/°C; Max Operating Temperature: 155°C; Length: 6.3mm; Tolerance: 5%; Width: 0.124inch; Radiation Hardening: No; Termination: SMD/SMT; Military Standard: Not; Max Power Dissipation: 1W; Voltage Rating: 500V; Depth: 3.15mm; Number of Pins: 2; Number of Terminations: 2; Packaging: Tape and Reel; Composition: Thick Film; Lead Free: Lead Free; Case Code (Metric): 6432; Height: 0.6mm; Weight: 0.001429oz; Case Code (Imperial): 2512; Case/Package: 2512; Features: Automotive AEC-Q200; Package Quantity: 1; Contact Plating: Tin
R21 RS1 = Res3: Resistor; Published: 8-Jun-2000; LatestRevisionDate: 29-May-2009; LatestRevisionNote: IPC-7351 Footprint Added.; PackageReference: J1-0603; Publisher: Altium Limited; PackageDescription: Chip Resistor
R22 = CMP-1012-00623-1: 10K 0.1W 1% 0603 (1608 Metric)  SMD; Value: 10000.00 Ohm; Case-EIA: 0603; Case-Metric: 1608; Power: 0.1 W; Tolerance: 1 %; Technology: SMT
R23 R24 = CMP-2000-03695-1: Manufacturer: Vishay Dale; Part Number: TNPW060310R0BEEA
R25 = RC0402FR-0747KL: RES, 47.0 k, 1%, 0.0625 W, 0402; Manufacturer: Yageo America; CompType: Resistor; Value: 47.0k; Res_ohm: 47000; Value_Code: 47k0; Tolerance_%: 1; Power_W: 0.0625; VDC_V: 50; TempCo: 100 ppm/C; SizeArea_mm2: 0.5; SizeZ_mm: 0.6; U/M: EA; AEC Category: Q200; AEC Qualified: N; SymbolVersion: 2009-05-29; PartNumber: RC0402FR-0747KL; PackageReference: 0402; RoHS: Y; Value1: 1%; Value2: 0.0625W; MountType: SMT; Technology: Thick Film; SizeX_mm: 1; SizeY_mm: 0.5; Published: 2008-06-26; Publisher: Texas Instruments; LatestRevisionDate: 2017-01-28; ComponentLink1Description: Datasheet link; ComponentLink1URL: http://www.yageo.com/documents/recent/PYu-RC0402_51_RoHS_L_6_r.pdf; Supplier 1: Digi-Key; Supplier Part Number 1: 311-47.0KLRCT-ND; Supplier 2: Newark; Supplier Part Number 2: 67R9937; Supplier 3: Mouser; Supplier Part Number 3: 603-RC0402FR-0747KL; AEC Grade: N/A
Rfbb1 = 0603 82KΩ (8202) 1%: SMD 1/10Watt 100Kohms 1%; ComponentLink1Description: 供应商链接; ComponentLink1URL: http://www.szlcsc.com/product/details_23981.html; Package: 0603; Supplier: LC; SuppliersPartNumber: C23254
Rfbt1 = R: 贴片电阻562K; BOM名称: 贴片电阻; 学习资源: www.ooocke.com
SW1 = CMP-08834-000056-1: SWITCH TACTILE SPST-NO 0.05A 24V; Illumination Type: Non-Illuminated; Switch Travel: 0.25mm; Electrical Life: 1000000Cycles; Mechanical Life: 500000Cycles; Current Rating: 50mA; Operating Force: 0.98N; Actuator Type: Standard; Switch Function: Off-Mom; Number of Poles: 1; Insulation Resistance: 100MR; Throw Configuration: SPST; Actuator Color: Black; Actuator Length: 6.1mm; Orientation: Straight; Contact Material: Gold; Weight: 0.25g; Lead Free: Lead Free; Packaging: Bulk; Series: B3F; Voltage Rating (DC): 24V; Length: 6mm; RoHS Compliant: Yes; Max Operating Temperature: 70°C; Max Voltage Rating (DC): 24V; Termination: PC Pins; Mount: Through Hole; Max Current Rating: 50mA; Min Operating Temperature: -25°C; Contact Current Rating: 50mA; Contact Plating: Silver; Depth: 7.7mm; Package Quantity: 1000; Contact Resistance: 100mR
SW2 = CMP-08834-000047-1: SWITCH TACTILE SPST-NO 0.05A 24V; Actuator Type: Standard; Throw Configuration: SPST; Illumination Type: Non-Illuminated; Contact Current Rating: 50mA; Actuator Length: 0.9mm; Electrical Life: 50000Cycles; Number of Poles: 1; Contact Resistance: 100mR; Ratings: IP00; Switch Function: Off-Mom; Operating Force: 4.9N; Switch Travel: 0.25mm; Actuator Color: Red; Length: 6mm; Packaging: Bag; Voltage Rating (DC): 24V; Depth: 6mm; Min Operating Temperature: -25°C; Orientation: Straight; Mount: Through Hole; Max Operating Temperature: 70°C; Mechanical Life: 50000Cycles; Height: 4.3mm; Max Voltage Rating (DC): 24V; Contact Plating: Silver; Lead Free: Lead Free; Width: 6mm; Current Rating: 50mA; Series: B3F; Termination: PC Pins; Contact Material: Gold; Weight: 0.25g; Max Current Rating: 50mA; Package Quantity: 1500
TP1-TP5 = TestPoint_SMT_11: IC-DS1_DIS_GND
U1 = CH340G: MF: {'manufacturer': u'WCH'}; MP: CH340G; Availability: Unavailable; Package: None; Price: None; Value: *
U4 = CMP-0388-00113-2: 28 V, 400 mA Switch Boost Converter for White LED Applications, 1.8 to 6 V, -40 to 85 degC, 5-pin SOT23 (DBV5), Green (RoHS & no Sb/Br); Manufacturer: Texas Instruments; Switching Frequency(Max)(kHz): 1000; Rating: Catalog; Dimming: TRUE; Iq(Typ)(mA): 0.028; Iout(Max)(A): 0.09; SubFamily: White LED Driver; Vin(Min)(V): 1.8; Vin(Max)(V): 6; PackageDescription: 5-Pin Plastic Small Outline, Body 1.60 Ãƒâ€” 2.90 mm, Pitch 0.95 mm; Eco-Plan: Green (RoHS & no Sb/Br); ComponentLink1Description: Manufacturer URL; ComponentLink1URL: http://www.ti.com/; PackageVersion: 4073253-4/K; ComponentLink2Description: Datasheet; ComponentLink2URL: http://www.ti.com/general/docs/lit/getliterature.tsp?genericPartNumber=TPS61040&fileType=pdf; Code_JEDEC: MO-178; DatasheetVersion: SLVS413F; Mounting Technology: Surface Mount; PackageReference: DBV0005A; PartNumber: TPS61040DBVR; Topology: Boost; ComponentLink3Description: Package Specification; ComponentLink3URL: http://www.ti.com/litv/pdf/mpds018i
U5 U6 = MAX98300+: Mono 2.6W ClassD Amp.
U7 = CMP-0063-01127-3: 2MHz, 600mA Step-Down DC-DC Converter, 5-pin SOT-23, Pb-Free; Manufacturer: Texas Instruments; PackageTopMarking: SBTB*XTT; PowerWise: Y; CompType: MiscPower; RoHS: Y; PinCount: 5; ComponentLink1Description: Datasheet URL; PackageDescription: Molded SOT-23, .115 x .063 x .040 in Body, 5 Lead, .0375 in Pitch; PackageReference: DBV0005A; ComponentLink1URL: http://www.ti.com/general/docs/lit/getliterature.tsp?genericPartNumber=LM3671&fileType=pdf
U8 = CMP-0254-00244-1: Extremely Accurate I2C-Integrated Real-Time Clock/TCXO/Crystal, 16-Pin SO, 0 to 70 degC; Code_IPC: SOIC127P1030-16; ComponentLink2Description: Datasheet; ComponentLink1URL: http://www.maxim-ic.com; PackageDescription: 16-Pin Small-Outline IC, Wide (0.3in), 1.27 mm Pitch, SOIC (W); PackageReference: W16-H2; ComponentLink2URL: http://datasheets.maxim-ic.com/en/ds/DS3231.pdf; DatasheetVersion: Rev 8, Jul-2010; PackageVersion: revD, 2010; ComponentLink1Description: Manufacturer URL; ComponentLink3Description: Package Specification; Code_JEDEC: MS-013-AA; ComponentLink3URL: http://pdfserv.maxim-ic.com/package_dwgs/21-0042.PDF
V1 = 8-MD-06INKM: 8 BIT VFD
X1 = CMP-2000-06123-1: Ceramic Resonator, 12 MHz, +/- 0.5%, -40 to 125 degC, 3-Pin SMD, RoHS, Tape and Reel; Manufacturer: Murata; Impedance: 30Ohm; Frequency Stability: ±0.2%; Catalog Drawings: CSTCE-(G,V)SeriesSide2 / CSTCE-(G,V)SeriesTop / CSTCE-(G,V)SeriesSide1 / CSTCE-(G,V)SeriesBottom; Dynamic Catalog: CERALOCK®,CSTCESeries; Frequency: 12MHz; Other Names: 490-1220-6; Capacitance: 33pF; Size / Dimension: 0.126"Lx0.051"W(3.20mmx1.30mm); Operating Temperature: -40°C~125°C; Packaging: Digi-Reel®; Family: Resonators; Datasheet Version: 12/2015; Mounting Technology: SurfaceMount; Package Reference: CSTCE_G; Series: CERALOCK®; Height: 0.031"(0.80mm); Standard Package: 1; Datasheet URL: http://www.murata.com/~/media/webrenewal/support/library/catalog/products/timingdevice/ceralock/p16e.ashx; Package / Case: 3-SMD,Non-Standard; Frequency Tolerance: ±0.5%; Features: BuiltinCapacitor; Manufacturer URL: http://www.murata.com/; Category: CrystalsandOscillators; Mounting Type: SurfaceMount; Package Description: 3-Pin Surface Mount Device, Body 3.2 x 1.3 mm, Pitch 1.2 mm; Type: Ceramic